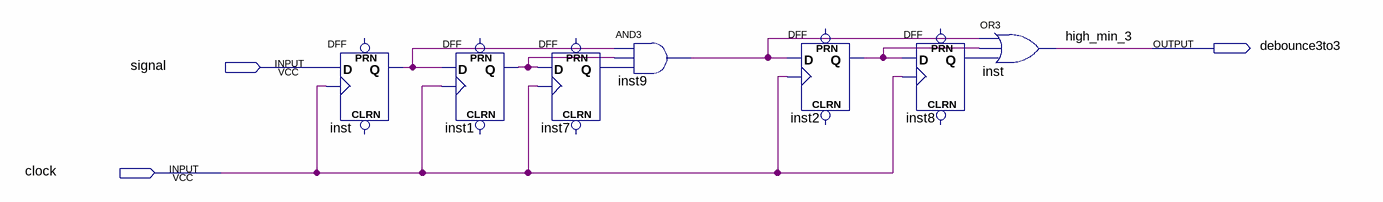
[diagram p0: schematic sheet]
// Quartus schematic debounce3to3.bdf as structural Verilog: 7 symbols, 3 pins
module debounce3to3 (
  input  signal,
  input  clock,
  output debounce3to3
);

  wire inst1_q, inst2_q, inst7_q, inst8_q, inst9_out, inst_q;

  DFF inst (.CLK(clock), .D(signal), .Q(inst_q));  // open: CLRN, PRN
  DFF inst1 (.CLK(clock), .D(inst_q), .Q(inst1_q));  // open: CLRN, PRN
  DFF inst7 (.CLK(clock), .D(inst1_q), .Q(inst7_q));  // open: CLRN, PRN
  and inst9 (inst9_out, inst_q, inst1_q, inst7_q);
  DFF inst2 (.CLK(clock), .D(inst9_out), .Q(inst2_q));  // open: CLRN, PRN
  DFF inst8 (.CLK(clock), .D(inst2_q), .Q(inst8_q));  // open: CLRN, PRN
  or inst_dup2 (debounce3to3, inst9_out, inst2_q, inst8_q);

  // Other names for the same wires on the sheet: high_min_3 = debounce3to3
endmodule
